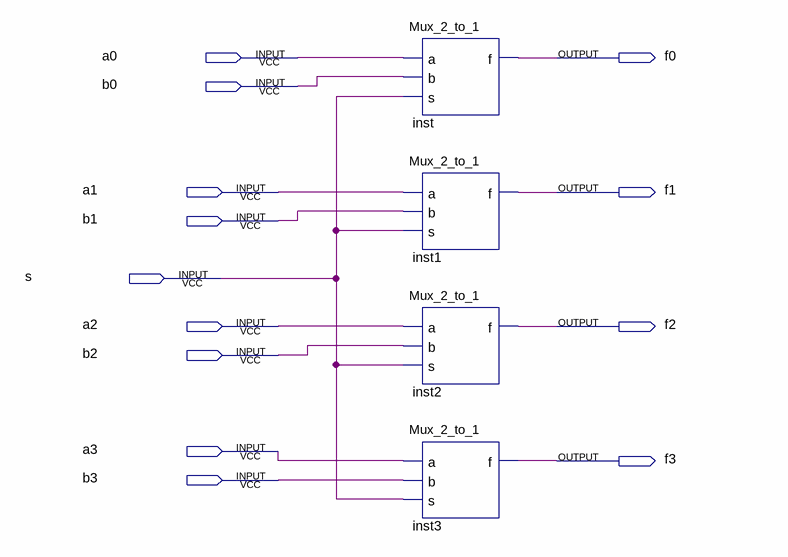
[diagram p0: schematic sheet]
// Quartus schematic Block_4_to_to_Mux.bdf as structural Verilog: 4 symbols, 13 pins
module Block_4_to_to_Mux (
  input  a0,
  input  b0,
  input  a1,
  input  b1,
  input  s,
  input  a2,
  input  b2,
  input  a3,
  input  b3,
  output f0,
  output f1,
  output f2,
  output f3
);

  Mux_2_to_1 inst (.a(a0), .b(b0), .s(s), .f(f0));
  Mux_2_to_1 inst1 (.a(a1), .b(b1), .s(s), .f(f1));
  Mux_2_to_1 inst2 (.a(a2), .b(b2), .s(s), .f(f2));
  Mux_2_to_1 inst3 (.a(a3), .b(b3), .s(s), .f(f3));
endmodule
